# Altium project control_plane (ye-sheng kuo's conflicted copy 2015-02-11).PrjPcb
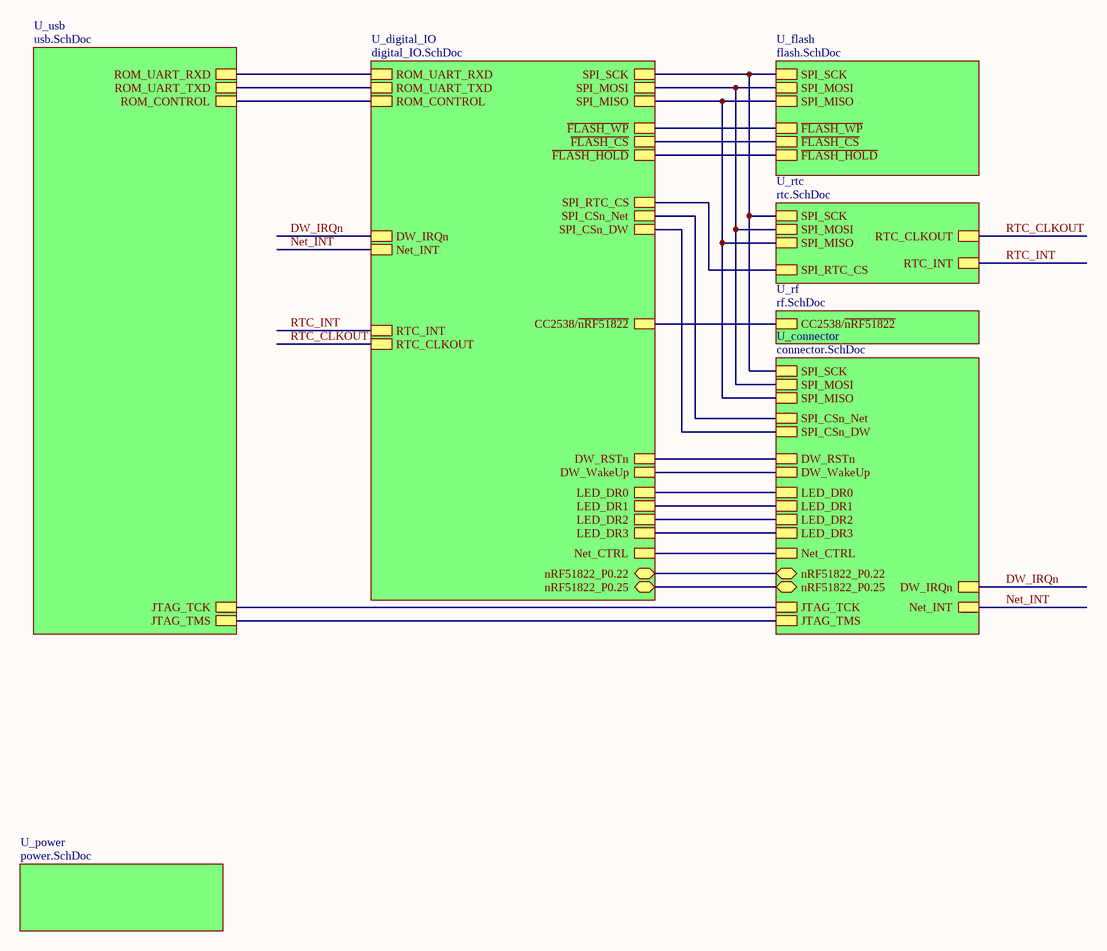
[diagram p0: top.SchDoc]
8 sheets, 101 parts. Net scope: hierarchical (ports join the sheet entries above them; power ports are global).
Board file: control_plane.PcbDoc
Sheets:
  top.SchDoc
    U_digital_IO = digital_IO.SchDoc
    U_flash = flash.SchDoc
    U_power = power.SchDoc
    U_rf = rf.SchDoc
    U_rtc = rtc.SchDoc
    U_usb = usb.SchDoc
    U_connector = connector.SchDoc

## Sheet top.SchDoc: Control Plane
size Letter; Author: Ye-Sheng Kuo; Revision: 2; SheetNumber: 1; SheetTotal: 8

### Sub-sheets
U_connector = connector.SchDoc: JTAG_TCK, JTAG_TMS, SPI_SCK, SPI_MOSI, SPI_MISO, SPI_CSn_Net, DW_RSTn, DW_WakeUp, DW_IRQn, Net_INT, LED_DR0, LED_DR1, LED_DR2, LED_DR3, Net_CTRL, SPI_CSn_DW, nRF51822_P0.22, nRF51822_P0.25
U_digital_IO = digital_IO.SchDoc: ROM_UART_RXD, ROM_UART_TXD, ROM_CONTROL, ~{FLASH_WP}, ~{FLASH_CS}, ~{FLASH_HOLD}, RTC_CLKOUT, SPI_SCK, SPI_MOSI, SPI_MISO, CC2538/~{nRF51822}, SPI_RTC_CS, RTC_INT, SPI_CSn_Net, SPI_CSn_DW, DW_RSTn, DW_WakeUp, DW_IRQn, Net_INT, LED_DR0, LED_DR1, LED_DR2, LED_DR3, Net_CTRL, nRF51822_P0.22, nRF51822_P0.25
U_flash = flash.SchDoc: ~{FLASH_WP}, ~{FLASH_CS}, ~{FLASH_HOLD}, SPI_SCK, SPI_MOSI, SPI_MISO
U_power = power.SchDoc: no entries
U_rf = rf.SchDoc: CC2538/~{nRF51822}
U_rtc = rtc.SchDoc: SPI_SCK, SPI_MOSI, SPI_MISO, SPI_RTC_CS, RTC_INT, RTC_CLKOUT
U_usb = usb.SchDoc: ROM_UART_RXD, ROM_UART_TXD, ROM_CONTROL, JTAG_TCK, JTAG_TMS

### Nets
CC2538/~{nRF51822}: sheet U_digital_IO/CC2538/~{nRF51822}, sheet U_rf/CC2538/~{nRF51822}
DW_IRQn: sheet U_digital_IO/DW_IRQn, sheet U_connector/DW_IRQn
DW_RSTn: sheet U_digital_IO/DW_RSTn, sheet U_connector/DW_RSTn
DW_WakeUp: sheet U_digital_IO/DW_WakeUp, sheet U_connector/DW_WakeUp
~{FLASH_CS}: sheet U_digital_IO/~{FLASH_CS}, sheet U_flash/~{FLASH_CS}
~{FLASH_HOLD}: sheet U_digital_IO/~{FLASH_HOLD}, sheet U_flash/~{FLASH_HOLD}
~{FLASH_WP}: sheet U_digital_IO/~{FLASH_WP}, sheet U_flash/~{FLASH_WP}
JTAG_TCK: sheet U_usb/JTAG_TCK, sheet U_connector/JTAG_TCK
JTAG_TMS: sheet U_usb/JTAG_TMS, sheet U_connector/JTAG_TMS
LED_DR0: sheet U_digital_IO/LED_DR0, sheet U_connector/LED_DR0
LED_DR1: sheet U_digital_IO/LED_DR1, sheet U_connector/LED_DR1
LED_DR2: sheet U_digital_IO/LED_DR2, sheet U_connector/LED_DR2
LED_DR3: sheet U_digital_IO/LED_DR3, sheet U_connector/LED_DR3
Net_CTRL: sheet U_digital_IO/Net_CTRL, sheet U_connector/Net_CTRL
Net_INT: sheet U_digital_IO/Net_INT, sheet U_connector/Net_INT
nRF51822_P0.22: sheet U_digital_IO/nRF51822_P0.22, sheet U_connector/nRF51822_P0.22
nRF51822_P0.25: sheet U_digital_IO/nRF51822_P0.25, sheet U_connector/nRF51822_P0.25
RTC_CLKOUT: sheet U_digital_IO/RTC_CLKOUT, sheet U_rtc/RTC_CLKOUT
RTC_INT: sheet U_digital_IO/RTC_INT, sheet U_rtc/RTC_INT
SPI_CSn_DW: sheet U_digital_IO/SPI_CSn_DW, sheet U_connector/SPI_CSn_DW
SPI_CSn_Net: sheet U_digital_IO/SPI_CSn_Net, sheet U_connector/SPI_CSn_Net
SPI_MISO: sheet U_digital_IO/SPI_MISO, sheet U_flash/SPI_MISO, sheet U_rtc/SPI_MISO, sheet U_connector/SPI_MISO
SPI_MOSI: sheet U_digital_IO/SPI_MOSI, sheet U_flash/SPI_MOSI, sheet U_rtc/SPI_MOSI, sheet U_connector/SPI_MOSI
SPI_RTC_CS: sheet U_digital_IO/SPI_RTC_CS, sheet U_rtc/SPI_RTC_CS
SPI_SCK: sheet U_digital_IO/SPI_SCK, sheet U_flash/SPI_SCK, sheet U_rtc/SPI_SCK, sheet U_connector/SPI_SCK
NetU3_16: sheet U_digital_IO/ROM_UART_RXD, sheet U_usb/ROM_UART_RXD
NetU3_17: sheet U_digital_IO/ROM_UART_TXD, sheet U_usb/ROM_UART_TXD
NetU3_18: sheet U_digital_IO/ROM_CONTROL, sheet U_usb/ROM_CONTROL

### Notes on the sheet
- Title
- Date:
- Author:
- Revision:
- Sheet
- of
- University of Michigan
- File:

## Sheet digital_IO.SchDoc: Control Plane
size Letter; Author: Ye-Sheng Kuo; Revision: 2; SheetNumber: 4; SheetTotal: 8
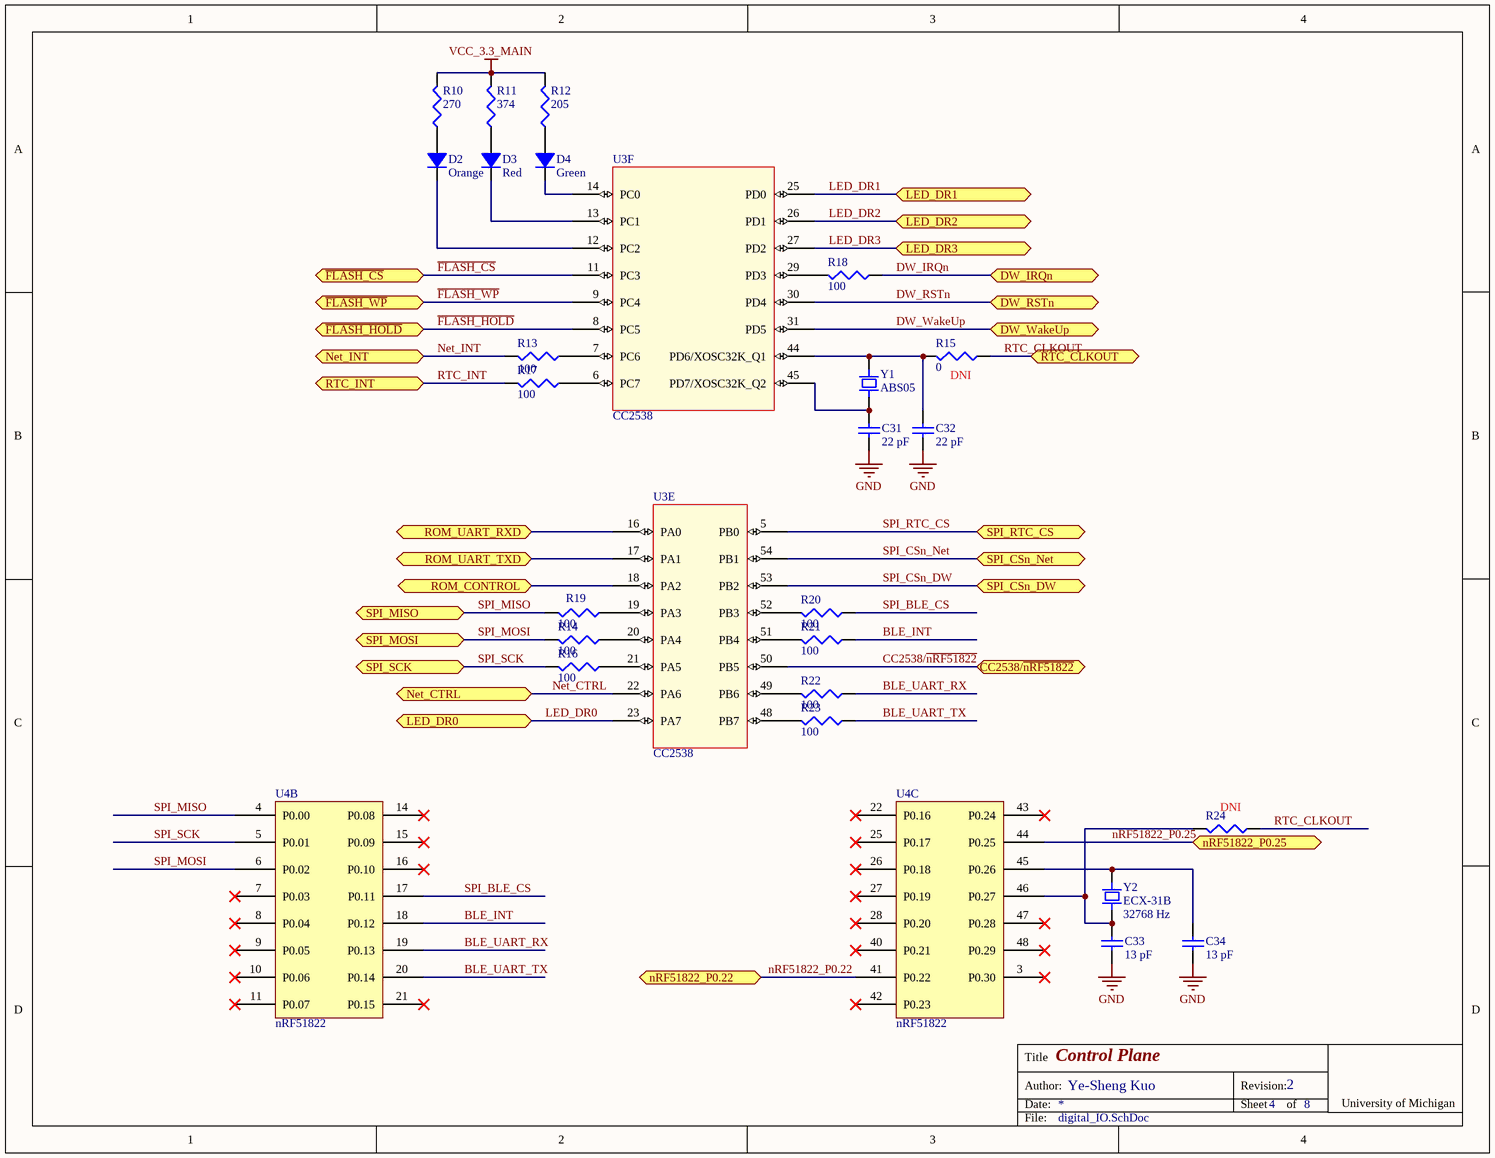
[diagram p1: digital_IO.SchDoc]

### Parts
C31  value 22 pF  [0402]  (hidden comment: Ceramic capacitor)
C32  value 22 pF  [0402]  (hidden comment: Ceramic capacitor)
C33  value 13 pF  [0402]  (hidden comment: Ceramic capacitor)
C34  value 13 pF  [0402]  (hidden comment: Ceramic capacitor)
D2  Color: Orange  [0402 - DIODE]  (hidden comment: LED, Orange)
D3  Color: Red  [0402 - DIODE]  (hidden comment: LED, Red)
D4  Color: Green  [0402 - DIODE]  (hidden comment: LED, Green)
R10  value 270  [0402]  (hidden comment: Chip resistor)
R11  value 374  [0402]  (hidden comment: Chip resistor)
R12  value 205  [0402]  (hidden comment: Chip resistor)
R13  value 100  [0402]  (hidden comment: Chip resistor)
R14  value 100  [0402]  (hidden comment: Chip resistor)
R15  value 0  [0402]  (hidden comment: Chip resistor)
R16  value 100  [0402]  (hidden comment: Chip resistor)
R17  value 100  [0402]  (hidden comment: Chip resistor)
R18  value 100  [0402]  (hidden comment: Chip resistor)
R19  value 100  [0402]  (hidden comment: Chip resistor)
R20  value 100  [0402]  (hidden comment: Chip resistor)
R21  value 100  [0402]  (hidden comment: Chip resistor)
R22  value 100  [0402]  (hidden comment: Chip resistor)
R23  value 100  [0402]  (hidden comment: Chip resistor)
R24  value 0  [0402]  (hidden comment: Chip resistor)
U3  CC2538  [QFN56]  (parts E,F of 6)
U4  nRF51822  [QFN-48]  (parts B,C of 5)
Y1  ABS05  [ABS05]
Y2  ECX-31B  Frequency: 32768 Hz  [ECX-31B]

### Ports
CC2538/~{nRF51822}, DW_IRQn, DW_RSTn, DW_WakeUp, LED_DR0, LED_DR1, LED_DR2, LED_DR3, Net_CTRL, Net_INT, nRF51822_P0.22, nRF51822_P0.25, ROM_CONTROL, ROM_UART_RXD, ROM_UART_TXD, RTC_CLKOUT, RTC_INT, SPI_CSn_DW, SPI_CSn_Net, SPI_MISO, SPI_MOSI, SPI_RTC_CS, SPI_SCK, ~{FLASH_CS}, ~{FLASH_HOLD}, ~{FLASH_WP}

### Nets
GND: C31.2 C32.2 C33.2 C34.2
VCC_3.3_MAIN: R10.1 R11.1 R12.1
BLE_INT: R21.2 U4.18(P0.12)
BLE_UART_RX: R22.2 U4.19(P0.13)
BLE_UART_TX: R23.2 U4.20(P0.14)
CC2538/~{nRF51822}: U3.50(PB5) ; port CC2538/~{nRF51822}
DW_IRQn: R18.2 ; port DW_IRQn
DW_RSTn: U3.30(PD4) ; port DW_RSTn
DW_WakeUp: U3.31(PD5) ; port DW_WakeUp
~{FLASH_CS}: U3.11(PC3) ; port ~{FLASH_CS}
~{FLASH_HOLD}: U3.8(PC5) ; port ~{FLASH_HOLD}
~{FLASH_WP}: U3.9(PC4) ; port ~{FLASH_WP}
LED_DR0: U3.23(PA7) ; port LED_DR0
LED_DR1: U3.25(PD0) ; port LED_DR1
LED_DR2: U3.26(PD1) ; port LED_DR2
LED_DR3: U3.27(PD2) ; port LED_DR3
Net_CTRL: U3.22(PA6) ; port Net_CTRL
Net_INT: R13.1 ; port Net_INT
nRF51822_P0.22: U4.41(P0.22) ; port nRF51822_P0.22
nRF51822_P0.25: U4.44(P0.25) ; port nRF51822_P0.25
RTC_CLKOUT: R15.2 R24.2 ; port RTC_CLKOUT
RTC_INT: R17.1 ; port RTC_INT
SPI_BLE_CS: R20.2 U4.17(P0.11)
SPI_CSn_DW: U3.53(PB2) ; port SPI_CSn_DW
SPI_CSn_Net: U3.54(PB1) ; port SPI_CSn_Net
SPI_MISO: R19.1 U4.4(P0.00) ; port SPI_MISO
SPI_MOSI: R14.1 U4.6(P0.02) ; port SPI_MOSI
SPI_RTC_CS: U3.5(PB0) ; port SPI_RTC_CS
SPI_SCK: R16.1 U4.5(P0.01) ; port SPI_SCK
NetC31_1: C31.1 U3.45(PD7/XOSC32K_Q2) Y1.2
NetC32_1: C32.1 R15.1 U3.44(PD6/XOSC32K_Q1) Y1.1
NetC33_1: C33.1 R24.1 U4.46(P0.27) Y2.2
NetC34_1: C34.1 U4.45(P0.26) Y2.1
NetD2_1: D2.1 R10.2
NetD2_2: D2.2 U3.12(PC2)
NetD3_1: D3.1 R11.2
NetD3_2: D3.2 U3.13(PC1)
NetD4_1: D4.1 R12.2
NetD4_2: D4.2 U3.14(PC0)
NetR13_2: R13.2 U3.7(PC6)
NetR14_2: R14.2 U3.20(PA4)
NetR16_2: R16.2 U3.21(PA5)
NetR17_2: R17.2 U3.6(PC7)
NetR18_1: R18.1 U3.29(PD3)
NetR19_2: R19.2 U3.19(PA3)
NetR20_1: R20.1 U3.52(PB3)
NetR21_1: R21.1 U3.51(PB4)
NetR22_1: R22.1 U3.49(PB6)
NetR23_1: R23.1 U3.48(PB7)
NetU3_16: U3.16(PA0) ; port ROM_UART_RXD
NetU3_17: U3.17(PA1) ; port ROM_UART_TXD
NetU3_18: U3.18(PA2) ; port ROM_CONTROL

Not connected (* = marked no-connect by the designer): U4 3(P0.30)* 7(P0.03)* 8(P0.04)* 9(P0.05)* 10(P0.06)* 11(P0.07)* 14(P0.08)* 15(P0.09)* 16(P0.10)* 21(P0.15)* 22(P0.16)* 25(P0.17)* 26(P0.18)* 27(P0.19)* 28(P0.20)* 40(P0.21)* 42(P0.23)* 43(P0.24)* 47(P0.28)* 48(P0.29)*

### Notes on the sheet
- (near R15) DNI
- (near R24) DNI
- Title
- Date:
- Author:
- Revision:
- Sheet
- of
- University of Michigan
- File:

### Library data of the parts
C31 C32 = C_22p_0402_ceramic: Ceramic capacitor, 22 pF, 0402 package; Manufacture: Johanson; voltage rated: 50 V; tolerance: 2%; package: 0402; Supplier 1: Digi-Key; Supplier Part Number 1: 712-1274-1-ND
C33 C34 = C_13p_0402_50V_ceramic: Ceramic capacitor, 13 pF, 50 V, 0402 package; Manufacture: Murata; voltage rated: 50 V; tolerance: 5%; package: 0402; Supplier 1: Digi-Key; Supplier Part Number 1: 490-5925-1-ND
D2 = D_LED_ORANGE_0402: LED, Orange, 0402; Supplier 1: Digi-Key; Supplier Part Number 1: 511-1590-1-ND; package: 0402
D3 = D_LED_RED_0402: LED, Red, 0402; package: 0402; Supplier 1: Digi-Key; Supplier Part Number 1: 511-1593-1-ND
D4 = D_LED_GREEN_0402: LED, Green,  0402; package: 0402; Supplier 1: Digi-Key; Supplier Part Number 1: 511-1592-1-ND
R10 = R_270_0402: Chip resistor, 270, 0402 package; tolerance: 1%; power: 1/16 W; package: 0402; Supplier 1: Digi-Key; Supplier Part Number 1: 541-270LCT-ND
R11 = R_374_0402: Chip resistor, 374, 0402 package; tolerance: 1%; power: 1/16 W; package: 0402; Supplier 1: Digi-Key; Supplier Part Number 1: 541-374LCT-ND
R12 = R_205_0402: Chip resistor, 205, 0402 package; tolerance: 1%; power: 1/16 W; package: 0402; Supplier 1: Digi-Key; Supplier Part Number 1: 541-205LCT-ND
R13 R14 R16-R23 = R_100_0402: Chip resistor, 100, 0402 package; tolerance: 1%; power: 1/16 W; package: 0402; Supplier 1: Digi-Key; Supplier Part Number 1: 541-100LCT-ND
R15 R24 = R_0_0402: Chip resistor, 0, 0402 package; package: 0402; Supplier 1: Digi-Key; Supplier Part Number 1: 541-0.0YBCT-ND
U3 = CC2538: A Powerful System-On-Chip for 2.4-GHz IEEE 802.15.4, 6LoWPAN  and ZigBee Applications; Supplier 1: Digi-Key; Supplier Part Number 1: 296-35797-1-ND
U4 = nRF51822: Multiprotocol Bluetooth® low energy/2.4 GHz RF System on Chip; Supplier 1: Digi-Key; Supplier Part Number 1: 1490-1032-1-ND
Y1 = ABS05: 32768 Hz SMD Low profile crystal; Supplier 1: Digi-Key; Supplier Part Number 1: 535-11899-1-ND
Y2 = ECX-31B: SMD TUNING FORK CRYSTAL; Load capacitance: 9 pF; ESR: 70 Kohm; Shunt capacitance: 1.05 pF; Frequency tolerance: 20 ppm; Supplier 1: Digi-Key; Supplier Part Number 1: XC1950CT-ND

## Sheet flash.SchDoc: Control Plane
size Letter; Author: Ye-Sheng Kuo; Revision: 2; SheetNumber: 5; SheetTotal: 8
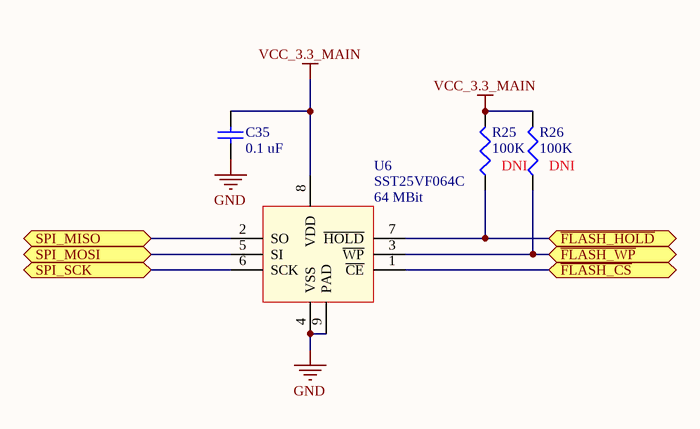
[diagram p2: flash.SchDoc]

### Parts
C35  value 0.1 uF  [0402]  (hidden comment: Ceramic capacitor)
R25  value 100K  [0402]  (hidden comment: Chip resistor)
R26  value 100K  [0402]  (hidden comment: Chip resistor)
U6  SST25VF064C  Capacity: 64 MBit  [WSON]

### Ports
SPI_MISO, SPI_MOSI, SPI_SCK, ~{FLASH_CS}, ~{FLASH_HOLD}, ~{FLASH_WP}

### Nets
GND: C35.2 U6.4(VSS) U6.9(PAD)
VCC_3.3_MAIN: C35.1 R25.1 R26.1 U6.8(VDD)
~{FLASH_CS}: U6.1(~{CE}) ; port ~{FLASH_CS}
~{FLASH_HOLD}: R25.2 U6.7(~{HOLD}) ; port ~{FLASH_HOLD}
~{FLASH_WP}: R26.2 U6.3(~{WP}) ; port ~{FLASH_WP}
SPI_MISO: U6.2(SO) ; port SPI_MISO
SPI_MOSI: U6.5(SI) ; port SPI_MOSI
SPI_SCK: U6.6(SCK) ; port SPI_SCK

### Notes on the sheet
- DNI
- (near R26) DNI
- Title
- Date:
- Author:
- Revision:
- Sheet
- of
- University of Michigan
- File:

### Library data of the parts
C35 = C_0.1u_10V_0402_ceramic: Ceramic capacitor, 0.1u, 0402 package; Manufacture: TDK; voltage rated: 10 V; tolerance: 10%; Supplier 1: Digi-Key; Supplier Part Number 1: 445-1265-1-ND; package: 0402
R25 R26 = R_100K_0402: Chip resistor, 100K, 0402 package; tolerance: 1%; power: 1/16 W; Supplier 1: Digi-Key; Supplier Part Number 1: 541-100KLCT-ND; package: 0402
U6 = SST25VF064C: 64 Mbit SPI Serial Dual I/O Flash; Supplier 1: Digi-Key; Supplier Part Number 1: SST25VF064C-80-4I-Q2AE-CT-ND

## Sheet power.SchDoc: Control Plane
size Letter; Author: Ye-Sheng Kuo; Revision: 2; SheetNumber: 2; SheetTotal: 8
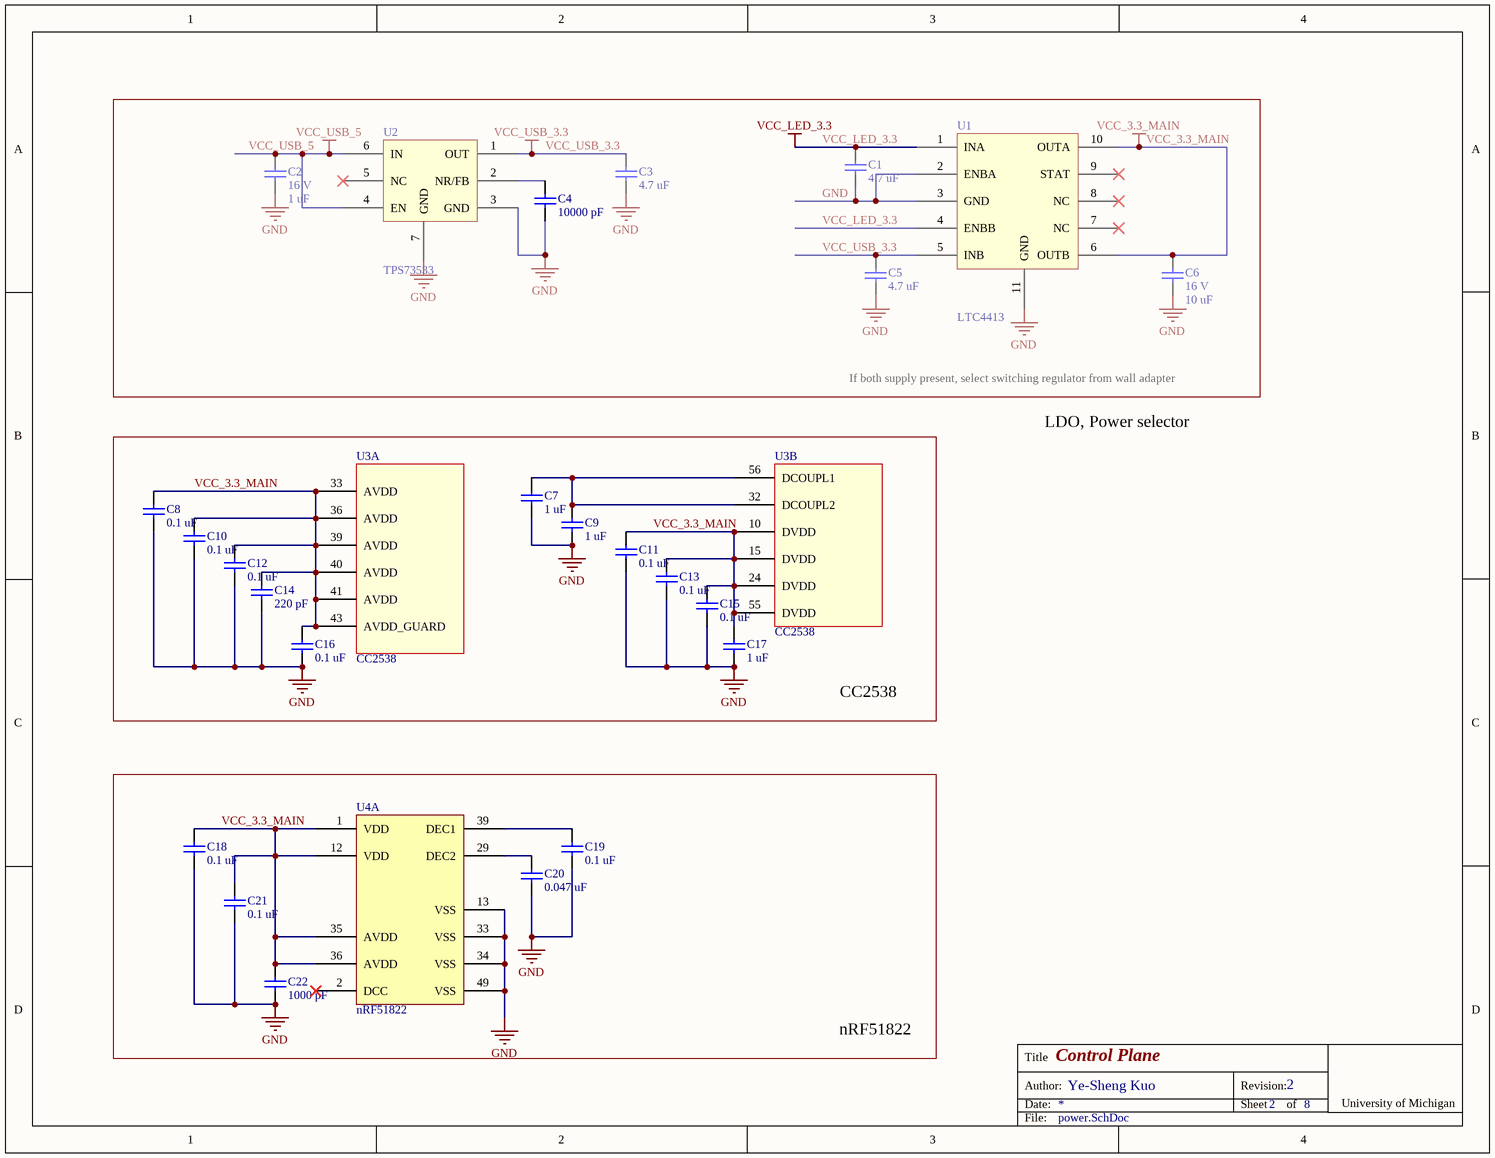
[diagram p3: power.SchDoc]

### Parts
C1  value 4.7 uF  [0603]  (hidden comment: Ceramic capacitor)
C2  value 1 uF  voltage rated: 16 V  [0603]  (hidden comment: Ceramic capacitor)
C3  value 4.7 uF  [0603]  (hidden comment: Ceramic capacitor)
C4  value 10000 pF  [0402]  (hidden comment: Ceramic capacitor)
C5  value 4.7 uF  [0603]  (hidden comment: Ceramic capacitor)
C6  value 10 uF  voltage rated: 16 V  [0603]  (hidden comment: Ceramic capacitor)
C7  value 1 uF  [0402]  (hidden comment: Ceramic capacitor)
C8  value 0.1 uF  [0402]  (hidden comment: Ceramic capacitor)
C9  value 1 uF  [0402]  (hidden comment: Ceramic capacitor)
C10  value 0.1 uF  [0402]  (hidden comment: Ceramic capacitor)
C11  value 0.1 uF  [0402]  (hidden comment: Ceramic capacitor)
C12  value 0.1 uF  [0402]  (hidden comment: Ceramic capacitor)
C13  value 0.1 uF  [0402]  (hidden comment: Ceramic capacitor)
C14  value 220 pF  [0402]  (hidden comment: Ceramic capacitor)
C15  value 0.1 uF  [0402]  (hidden comment: Ceramic capacitor)
C16  value 0.1 uF  [0402]  (hidden comment: Ceramic capacitor)
C17  value 1 uF  [0402]  (hidden comment: Ceramic capacitor)
C18  value 0.1 uF  [0402]  (hidden comment: Ceramic capacitor)
C19  value 0.1 uF  [0402]  (hidden comment: Ceramic capacitor)
C20  value 0.047 uF  [0402]  (hidden comment: Ceramic capacitor)
C21  value 0.1 uF  [0402]  (hidden comment: Ceramic capacitor)
C22  value 1000 pF  [0402]  (hidden comment: Ceramic capacitor)
U1  LTC4413  [DFN-10]
U2  TPS73533  [SON-6]
U3  CC2538  [QFN56]  (parts A,B of 6)
U4  nRF51822  [QFN-48]  (part A of 5)

### Nets
GND: C1.2 C2.2 C3.2 C4.2 C5.2 C6.2 C7.2 C8.2 C9.2 C10.2 C11.2 C12.2 C13.2 C14.2 C15.2 C16.2 C17.2 C18.2 C19.2 C20.2 C21.2 C22.2 U1.2(ENBA) U1.3(GND) U1.11(GND) U2.3(GND) U2.7(GND) U4.13(VSS) U4.33(VSS) U4.34(VSS) U4.49(VSS)
VCC_3.3_MAIN: C6.1 C8.1 C10.1 C11.1 C12.1 C13.1 C14.1 C15.1 C16.1 C17.1 C18.1 C21.1 C22.1 U1.6(OUTB) U1.10(OUTA) U3.10(DVDD) U3.15(DVDD) U3.24(DVDD) U3.33(AVDD) U3.36(AVDD) U3.39(AVDD) U3.40(AVDD) U3.41(AVDD) U3.43(AVDD_GUARD) U3.55(DVDD) U4.1(VDD) U4.12(VDD) U4.35(AVDD) U4.36(AVDD)
VCC_LED_3.3: C1.1 U1.1(INA) U1.4(ENBB)
VCC_USB_3.3: C3.1 C5.1 U1.5(INB) U2.1(OUT)
VCC_USB_5: C2.1 U2.4(EN) U2.6(IN)
NetC4_1: C4.1 U2.2(NR/FB)
NetC7_1: C7.1 C9.1 U3.32(DCOUPL2) U3.56(DCOUPL1)
NetC19_1: C19.1 U4.39(DEC1)
NetC20_1: C20.1 U4.29(DEC2)

Not connected (* = marked no-connect by the designer): U1 7(NC)* 8(NC)* 9(STAT)*; U2 5(NC)*; U4 2(DCC)*

### Notes on the sheet
- If both supply present, select switching regulator from wall adapter
- LDO, Power selector
- CC2538
- nRF51822
- Title
- Date:
- Author:
- Revision:
- Sheet
- of
- University of Michigan
- File:

### Library data of the parts
C1 C3 C5 = C_4.7u_10V_0603_ceramic: Ceramic capacitor, 4.7u, 10V, 0603 package; Manufacture: TDK; tolerance: 20%; Temp rating: X5R; package: 0603; voltage rated: 10 V; Supplier 1: Digi-Key; Supplier Part Number 1: 445-7482-1-ND
C2 = C_1u_16V_0603_ceramic: Ceramic capacitor, 1 uF, 16 V, 0603 package; Manufacture: TDK; tolerance: 10%; package: 0603; Supplier 1: Digi-Key; Supplier Part Number 1: 445-1604-1-ND
C4 = C_10000p_16V_0402_ceramic: Ceramic capacitor, 10000 pF, 16 V, 0402 package; Manufacture: Murata; voltage rated: 16 V; tolerance: 10%; Temperature Coefficient: X7R; package: 0402; Supplier 1: Digi-Key; Supplier Part Number 1: 490-1313-1-ND
C6 = C_10u_16V_0603_ceramic: Ceramic capacitor, 10 uF, 16 V, 0603 package; Manufacture: TDK; tolerance: 20%; Temperature Coefficient: X5R; package: 0603; Supplier 1: Digi-Key; Supplier Part Number 1: 445-9065-6-ND
C7 C9 C17 = C_1u_16V_0402_ceramic: Ceramic capacitor, 1 uF, 16V, 0402 package; Manufacture: TDK; tolerance: 10%; Temperature rating: X5R; voltage rated: 16 V; package: 0402; Supplier 1: Digi-Key; Supplier Part Number 1: 445-4978-1-ND
C8 C10-C13 C15 C16 C18 C19 C21 = C_0.1u_10V_0402_ceramic: as C35 on sheet flash; Supplier 1: Digi-Key; Supplier Part Number 1: 445-1265-1-ND; package: 0402
C14 = C_220p_50V_0402_ceramic: Ceramic capacitor, 220 pF, 0402 package; Manufacture: Johanson; voltage rated: 50 V; tolerance: 10%; package: 0402; Temperature: X7R; Supplier 1: Digi-Key; Supplier Part Number 1: 445-1254-1-ND
C20 = C_0.047u_16V_0402_ceramic: Ceramic capacitor, 0.047u, 16V, 0402 package; Manufacture: TDK; tolerance: 10%; Temperature rating: X7R; voltage rated: 16 V; package: 0402; Supplier 1: Digi-Key; Supplier Part Number 1: 445-1264-1-ND
C22 = C_1000p_50V_0402_ceramic: Ceramic capacitor, 1000 pF, 0402 package; Manufacture: TDK; voltage rated: 50 V; tolerance: 10%; package: 0402; Supplier 1: Digi-Key; Supplier Part Number 1: 445-6846-1-ND
U1 = LTC4413: Dual 2.6A, 2.5V to 5.5V,  Ideal Diodes in 3mm × 3mm DFN; Supplier 1: Digi-Key; Supplier Part Number 1: LTC4413EDD#TRPBFCT-ND
U2 = TPS73533: 500mA, Low Quiescent Current, Ultra-Low Noise, High PSRR  Low-Dropout Linear Regulator; Supplier 1: Digi-Key; Supplier Part Number 1: 296-24289-1-ND
U3 = CC2538: as U3 on sheet digital_IO; Supplier 1: Digi-Key; Supplier Part Number 1: 296-35797-1-ND
U4 = nRF51822: as U4 on sheet digital_IO; Supplier 1: Digi-Key; Supplier Part Number 1: 1490-1032-1-ND

## Sheet rf.SchDoc: Control Plane
size Letter; Author: Ye-Sheng Kuo; Revision: 2; SheetNumber: 7; SheetTotal: 8
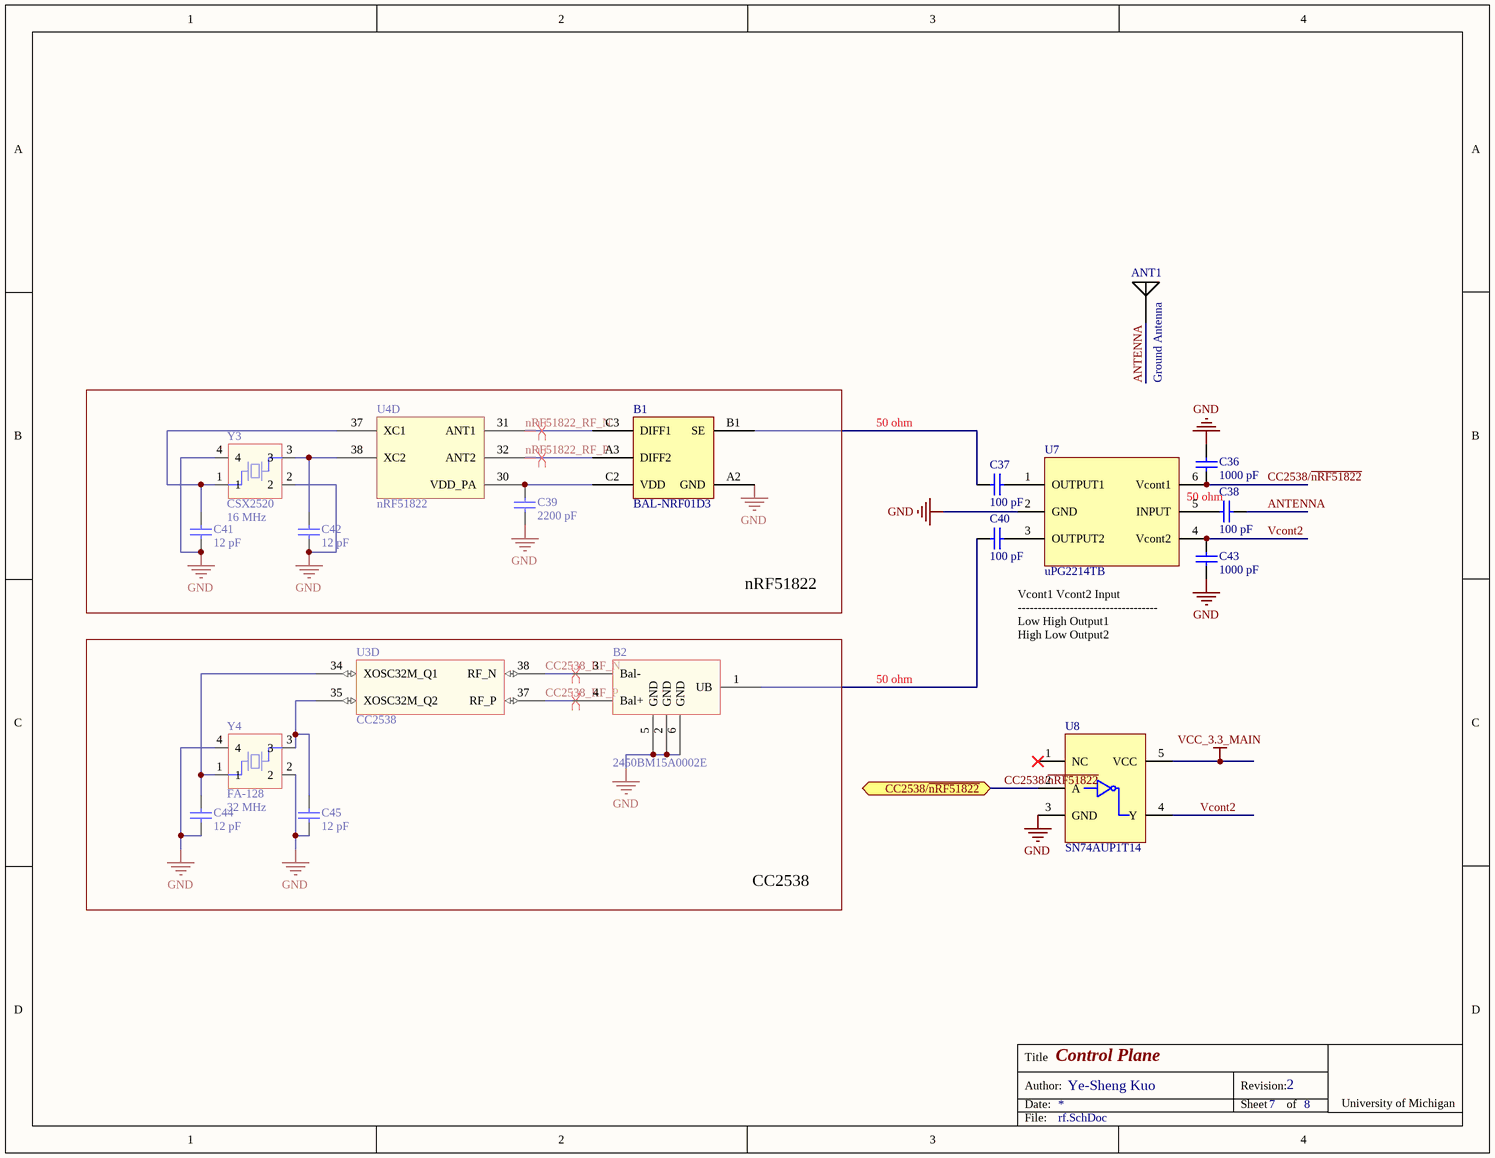
[diagram p4: rf.SchDoc]

### Parts
ANT1  Ground Antenna  [Chip Antenna]
B1  BAL-NRF01D3  [BAL-NRF01D3]
B2  2450BM15A0002E  [2450BM15A0002]
C36  value 1000 pF  [0402]  (hidden comment: Ceramic capacitor)
C37  value 100 pF  [0402]  (hidden comment: Ceramic capacitor)
C38  value 100 pF  [0402]  (hidden comment: Ceramic capacitor)
C39  value 2200 pF  [0402]  (hidden comment: Ceramic capacitor)
C40  value 100 pF  [0402]  (hidden comment: Ceramic capacitor)
C41  value 12 pF  [0402]  (hidden comment: Ceramic capacitor)
C42  value 12 pF  [0402]  (hidden comment: Ceramic capacitor)
C43  value 1000 pF  [0402]  (hidden comment: Ceramic capacitor)
C44  value 12 pF  [0402]  (hidden comment: Ceramic capacitor)
C45  value 12 pF  [0402]  (hidden comment: Ceramic capacitor)
U3  CC2538  [QFN56]  (part D of 6)
U4  nRF51822  [QFN-48]  (part D of 5)
U7  uPG2214TB  [minimold-6]
U8  SN74AUP1T14  [SC-70-5 (DCK)]
Y3  CSX2520  Frequency: 16 MHz  [CX2520]
Y4  FA-128  frequency: 32 MHz  [FA-128]

### Ports
CC2538/~{nRF51822}

### Nets
GND: B1.A2(GND) B2.2(GND) B2.5(GND) B2.6(GND) C36.1 C39.2 C41.1 C42.1 C43.2 C44.1 C45.1 U7.2(GND) U8.3(GND) Y3.2 Y3.4 Y4.2 Y4.4
VCC_3.3_MAIN: U8.5(VCC)
ANTENNA: ANT1.1 C38.2
CC2538/~{nRF51822}: C36.2 U7.6(Vcont1) U8.2(A) ; port CC2538/~{nRF51822}
CC2538_RF_N: B2.3(Bal-) U3.38(RF_N)
CC2538_RF_P: B2.4(Bal+) U3.37(RF_P)
nRF51822_RF_N: B1.C3(DIFF1) U4.31(ANT1)
nRF51822_RF_P: B1.A3(DIFF2) U4.32(ANT2)
Vcont2: C43.1 U7.4(Vcont2) U8.4(Y)
NetB1_B1: B1.B1(SE) C37.1
NetB1_C2: B1.C2(VDD) C39.1 U4.30(VDD_PA)
NetB2_1: B2.1(UB) C40.1
NetC37_2: C37.2 U7.1(OUTPUT1)
NetC38_1: C38.1 U7.5(INPUT)
NetC40_2: C40.2 U7.3(OUTPUT2)
NetC41_2: C41.2 U4.37(XC1) Y3.1
NetC42_2: C42.2 U4.38(XC2) Y3.3
NetC44_2: C44.2 U3.34(XOSC32M_Q1) Y4.1
NetC45_2: C45.2 U3.35(XOSC32M_Q2) Y4.3

Not connected (* = marked no-connect by the designer): U8 1(NC)*

### Layout directives
differential pair: CC2538_RF_N, CC2538_RF_P, nRF51822_RF_N, nRF51822_RF_P

### Notes on the sheet
- 50 ohm
- nRF51822
- (near C43) Vcont1	Vcont2	Input
  -----------------------------------
  Low	High	Output1
  High	Low	Output2
- CC2538
- Title
- Date:
- Author:
- Revision:
- Sheet
- of
- University of Michigan
- File:

### Library data of the parts
ANT1 = Ground Antenna: 2.4GHz Surface Mount Device (SMD) On Ground Antenna, 50 Ohms; Supplier 1: RichardsonRFPD; Supplier Part Number 1: FR05-S1-N-0102B
B1 = BAL-NRF01D3: 50 ohm nominal input / conjugate match balun to nRF51822-CEAA; Supplier 1: Digi-Key; Supplier Part Number 1: 497-13637-1-ND
B2 = 2450BM15A0002E: 2.45 GHz Balun for TI CC253X; Supplier 1: Digi-Key; Supplier Part Number 1: 712-1536-1-ND
C36 C43 = C_1000p_50V_0402_ceramic: as C22 on sheet power; package: 0402; Supplier 1: Digi-Key; Supplier Part Number 1: 445-6846-1-ND
C37 C38 C40 = C_100p_25V_0402_ceramic: Ceramic capacitor, 100 pF, 0402 package; Manufacture: Kemet; voltage rated: 25 V; tolerance: 1%; package: 0402; Supplier 1: Digi-Key; Supplier Part Number 1: 399-11246-1-ND
C39 = C_2200p_50V_0402_ceramic: Ceramic capacitor, 2200 pF, 0402 package; Manufacture: TDK; voltage rated: 50 V; tolerance: 10%; Temperature Coefficient: X7R; package: 0402; Supplier 1: Digi-Key; Supplier Part Number 1: 445-1257-1-ND
C41 C42 C44 C45 = C_12p_0402_ceramic: Ceramic capacitor, 12 pF, 0402 package; Manufacture: Johanson; voltage rated: 50 V; tolerance: 2%; package: 0402; Supplier 1: Digi-Key; Supplier Part Number 1: 712-1256-1-ND
U3 = CC2538: as U3 on sheet digital_IO; Supplier 1: Digi-Key; Supplier Part Number 1: 296-35797-1-ND
U4 = nRF51822: as U4 on sheet digital_IO; Supplier 1: Digi-Key; Supplier Part Number 1: 1490-1032-1-ND
U7 = uPG2214TB: GaAs Integrated Circuit for L, S-Band SPDT Switch; Supplier 1: Digi-Key; Supplier Part Number 1: UPG2214TB-E4-ACT-ND
U8 = SN74AUP1T14: LOW POWER, 1.8/2.5/3.3-V INPUT, 3.3-V CMOS OUTPUT, SINGLE  SCHMITT-TRIGGER INVERTER GATE; Supplier 1: Digi-Key; Supplier Part Number 1: 296-27392-1-ND
Y3 = CSX2520: Crystal oscillator; Load capacitance: 8 pF; Frequency stability: 15 ppm; Frequency tolerance: 10 ppm; ESR: 80 ohm; Supplier 1: Digi-Key; Supplier Part Number 1: 1253-1121-1-ND
Y4 = FA-128: MHz Range Crystal Unit; Load capatance: 10 pF; ESR: 60; stability: 20 ppm; Supplier 1: Digi-Key; Supplier Part Number 1: SER3800CT-ND

## Sheet rtc.SchDoc: Control Plane
size Letter; Author: Ye-Sheng Kuo; Revision: 2; SheetNumber: 8; SheetTotal: 8
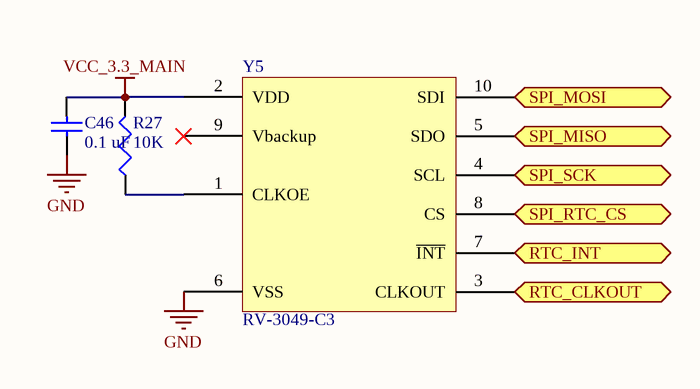
[diagram p5: rtc.SchDoc]

### Parts
C46  value 0.1 uF  [0402]  (hidden comment: Ceramic capacitor)
R27  value 10K  [0402]  (hidden comment: Chip resistor)
Y5  RV-3049-C3  [RV-3049-C3]

### Ports
RTC_CLKOUT, RTC_INT, SPI_MISO, SPI_MOSI, SPI_RTC_CS, SPI_SCK

### Nets
GND: C46.2 Y5.6(VSS)
VCC_3.3_MAIN: C46.1 R27.1 Y5.2(VDD)
RTC_CLKOUT: Y5.3(CLKOUT) ; port RTC_CLKOUT
RTC_INT: Y5.7(~{INT}) ; port RTC_INT
SPI_MISO: Y5.5(SDO) ; port SPI_MISO
SPI_MOSI: Y5.10(SDI) ; port SPI_MOSI
SPI_RTC_CS: Y5.8(CS) ; port SPI_RTC_CS
SPI_SCK: Y5.4(SCL) ; port SPI_SCK
NetR27_2: R27.2 Y5.1(CLKOE)

Not connected (* = marked no-connect by the designer): Y5 9(Vbackup)*

### Notes on the sheet
- Title
- Date:
- Author:
- Revision:
- Sheet
- of
- University of Michigan
- File:

### Library data of the parts
C46 = C_0.1u_10V_0402_ceramic: as C35 on sheet flash; Supplier 1: Digi-Key; Supplier Part Number 1: 445-1265-1-ND; package: 0402
R27 = R_10K_0402: Chip resistor, 10K, 0402 package; tolerance: 1%; power: 1/16 W; Supplier 1: Digi-Key; Supplier Part Number 1: 541-10.0KLDKR-ND; package: 0402
Y5 = RV-3049-C3: Real Time Clock Module with SPI-Bus

## Sheet usb.SchDoc: Control Plane
size Letter; Author: Ye-Sheng Kuo; Revision: 2; SheetNumber: 3; SheetTotal: 8
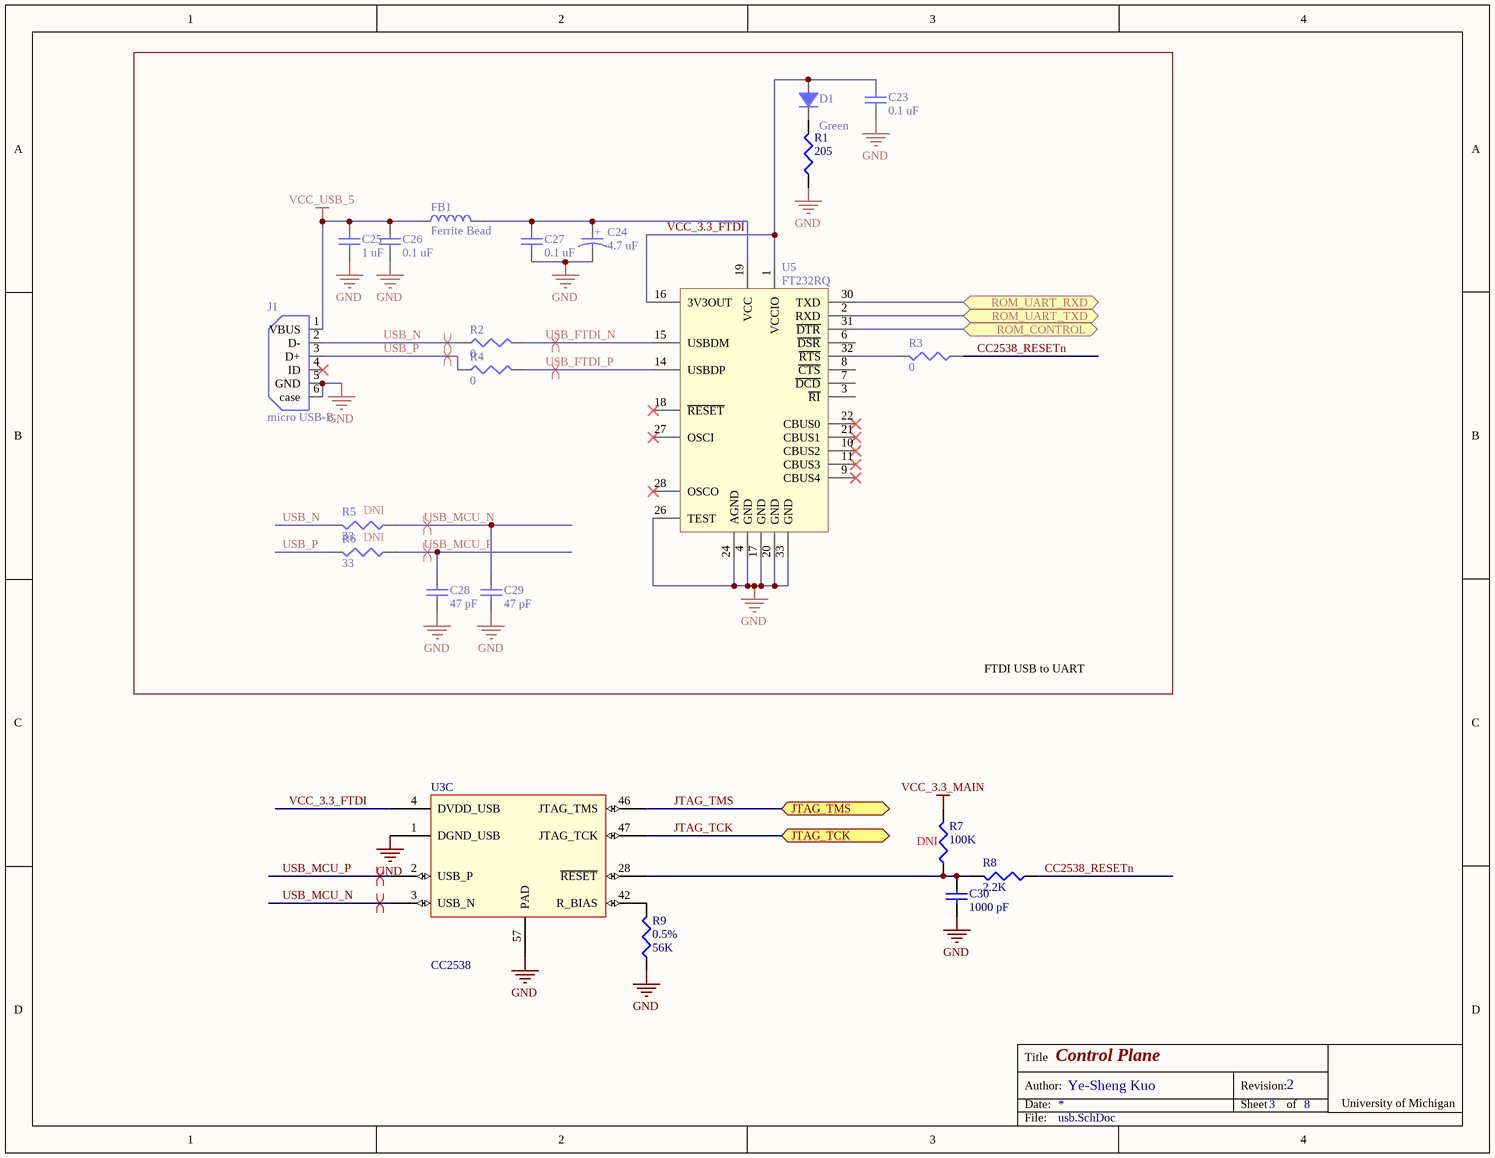
[diagram p6: usb.SchDoc]

### Parts
C23  value 0.1 uF  [0402]  (hidden comment: Ceramic capacitor)
C24  value 4.7 uF  [0603 - Polar Marking]  (hidden comment: Tantalum capacitor)
C25  value 1 uF  [0402]  (hidden comment: Ceramic capacitor)
C26  value 0.1 uF  [0402]  (hidden comment: Ceramic capacitor)
C27  value 0.1 uF  [0402]  (hidden comment: Ceramic capacitor)
C28  value 47 pF  [0402]  (hidden comment: Ceramic capacitor)
C29  value 47 pF  [0402]  (hidden comment: Ceramic capacitor)
C30  value 1000 pF  [0402]  (hidden comment: Ceramic capacitor)
D1  Color: Green  [0402 - DIODE]  (hidden comment: LED, Green)
FB1  Ferrite Bead  [0402]
J1  micro USB-B  [Micro USB-B]
R1  value 205  [0402]  (hidden comment: Chip resistor)
R2  value 0  [0402]  (hidden comment: Chip resistor)
R3  value 0  [0402]  (hidden comment: Chip resistor)
R4  value 0  [0402]  (hidden comment: Chip resistor)
R5  value 33  [0402]  (hidden comment: Chip resistor)
R6  value 33  [0402]  (hidden comment: Chip resistor)
R7  value 100K  [0402]  (hidden comment: Chip resistor)
R8  value 2.2K  [0402]  (hidden comment: Chip resistor)
R9  value 56K  tolerance: 0.5%  [0402]  (hidden comment: Chip resistor)
U3  CC2538  [QFN56]  (part C of 6)
U5  FT232RQ  [QFN-32]

### Ports
JTAG_TCK, JTAG_TMS, ROM_CONTROL, ROM_UART_RXD, ROM_UART_TXD

### Nets
GND: C23.2 C24.2 C25.2 C26.2 C27.2 C28.2 C29.2 C30.2 J1.5(GND) J1.6(case) R1.2 R9.2 U3.1(DGND_USB) U3.57(PAD) U5.4(GND) U5.17(GND) U5.20(GND) U5.24(AGND) U5.26(TEST) U5.33(GND)
VCC_3.3_MAIN: R7.1
VCC_USB_5: C25.1 C26.1 FB1.2 J1.1(VBUS)
CC2538_RESETn: R3.2 R8.2
JTAG_TCK: U3.47(JTAG_TCK) ; port JTAG_TCK
JTAG_TMS: U3.46(JTAG_TMS) ; port JTAG_TMS
USB_FTDI_N: R2.1 U5.15(USBDM)
USB_FTDI_P: R4.1 U5.14(USBDP)
USB_MCU_N: C29.1 R5.2 U3.3(USB_N)
USB_MCU_P: C28.1 R6.2 U3.2(USB_P)
USB_N: J1.2(D-) R2.2 R5.1
USB_P: J1.3(D+) R4.2 R6.1
VCC_3.3_FTDI: C23.1 D1.1 U3.4(DVDD_USB) U5.1(VCCIO) U5.16(3V3OUT)
NetC24_1: C24.1 C27.1 FB1.1 U5.19(VCC)
NetC30_1: C30.1 R7.2 R8.1 U3.28(~{RESET})
NetD1_2: D1.2 R1.1
NetR3_1: R3.1 U5.32(~{RTS})
NetR9_1: R9.1 U3.42(R_BIAS)
NetU3_16: U5.30(TXD) ; port ROM_UART_RXD
NetU3_17: U5.2(RXD) ; port ROM_UART_TXD
NetU3_18: U5.31(~{DTR}) ; port ROM_CONTROL

Not connected (* = marked no-connect by the designer): J1 4(ID)*; U5 3(~{RI}) 6(~{DSR}) 7(~{DCD}) 8(~{CTS}) 9(CBUS4)* 10(CBUS2)* 11(CBUS3)* 18(~{RESET})* 21(CBUS1)* 22(CBUS0)* 27(OSCI)* 28(OSCO)*

### Layout directives
differential pair: USB_FTDI_N, USB_FTDI_P, USB_MCU_N, USB_MCU_P, USB_N, USB_P

### Notes on the sheet
- (near R5) DNI
- DNI
- FTDI USB to UART
- (near R7) DNI
- Title
- Date:
- Author:
- Revision:
- Sheet
- of
- University of Michigan
- File:
- (in symbol C_4.7u_10V_0603_tantalum) +

### Library data of the parts
C23 C26 C27 = C_0.1u_10V_0402_ceramic: as C35 on sheet flash; Supplier 1: Digi-Key; Supplier Part Number 1: 445-1265-1-ND; package: 0402
C24 = C_4.7u_10V_0603_tantalum: Tantalum capacitor, 4.7 uF, 0603 package; Manufacture: Rohm; voltage rated: 10 V; tolerance: 20%; package: 0603; Supplier 1: Digi-Key; Supplier Part Number 1: 511-1496-1-ND
C25 = C_1u_16V_0402_ceramic: as C7 on sheet power; voltage rated: 16 V; package: 0402; Supplier 1: Digi-Key; Supplier Part Number 1: 445-4978-1-ND
C28 C29 = C_47p_0402_ceramic: Ceramic capacitor, 47 pF, 0402 package; Manufacture: Johanson; voltage rated: 50 V; tolerance: 5%; package: 0402; Supplier 1: Digi-Key; Supplier Part Number 1: 709-1121-1-ND
C30 = C_1000p_50V_0402_ceramic: as C22 on sheet power; package: 0402; Supplier 1: Digi-Key; Supplier Part Number 1: 445-6846-1-ND
D1 = D_LED_GREEN_0402: LED, Green,  0402; package: 0402; Supplier 1: Digi-Key; Supplier Part Number 1: 511-1592-1-ND
FB1 = FB_150mA_0402: Ferrite Bead, 150 mA, 0402 package; impedance@Freq: 1K@100 MHz; current rating: 150 mA; Supplier 1: Digi-Key; Supplier Part Number 1: 587-1835-1-ND; package: 0402
J1 = Micro USB: CONN USB MICRO B RECPT SMT R/A; Supplier 1: Digi-Key; Supplier Part Number 1: 609-4616-6-ND
R1 = R_205_0402: as R12 on sheet digital_IO; package: 0402; Supplier 1: Digi-Key; Supplier Part Number 1: 541-205LCT-ND
R2-R4 = R_0_0402: Chip resistor, 0, 0402 package; package: 0402; Supplier 1: Digi-Key; Supplier Part Number 1: 541-0.0YBCT-ND
R5 R6 = R_33_0402: Chip resistor, 33, 0402 package; tolerance: 1%; power: 1/16 W; package: 0402; Supplier 1: Digi-Key; Supplier Part Number 1: 541-33.0LCT-ND
R7 = R_100K_0402: as R25 on sheet flash; Supplier 1: Digi-Key; Supplier Part Number 1: 541-100KLCT-ND; package: 0402
R8 = R_2.2K_0402: Chip resistor, 2.2K, 0402 package; tolerance: 1%; power: 1/16 W; package: 0402; Supplier 1: Digi-Key; Supplier Part Number 1: 541-2.20KLCT-ND
R9 = R_56K_0402: Chip resistor, 56K, 0402 package; power: 1/16 W; Temperature coefficient: 25 ppm/C; package: 0402; Supplier 1: Digi-Key; Supplier Part Number 1: P56KDECT-ND
U3 = CC2538: as U3 on sheet digital_IO; Supplier 1: Digi-Key; Supplier Part Number 1: 296-35797-1-ND
U5 = FT232RQ: FT232R USB UART; Manufacturer: *; Note: *; ManufacturerPartNo: *; Supplier 1: Digi-Key; Supplier Part Number 1: 768-1008-1-ND

## Sheet connector.SchDoc: Control Plane
size Letter; Author: Ye-Sheng Kuo; Revision: 2; SheetNumber: 6; SheetTotal: 8
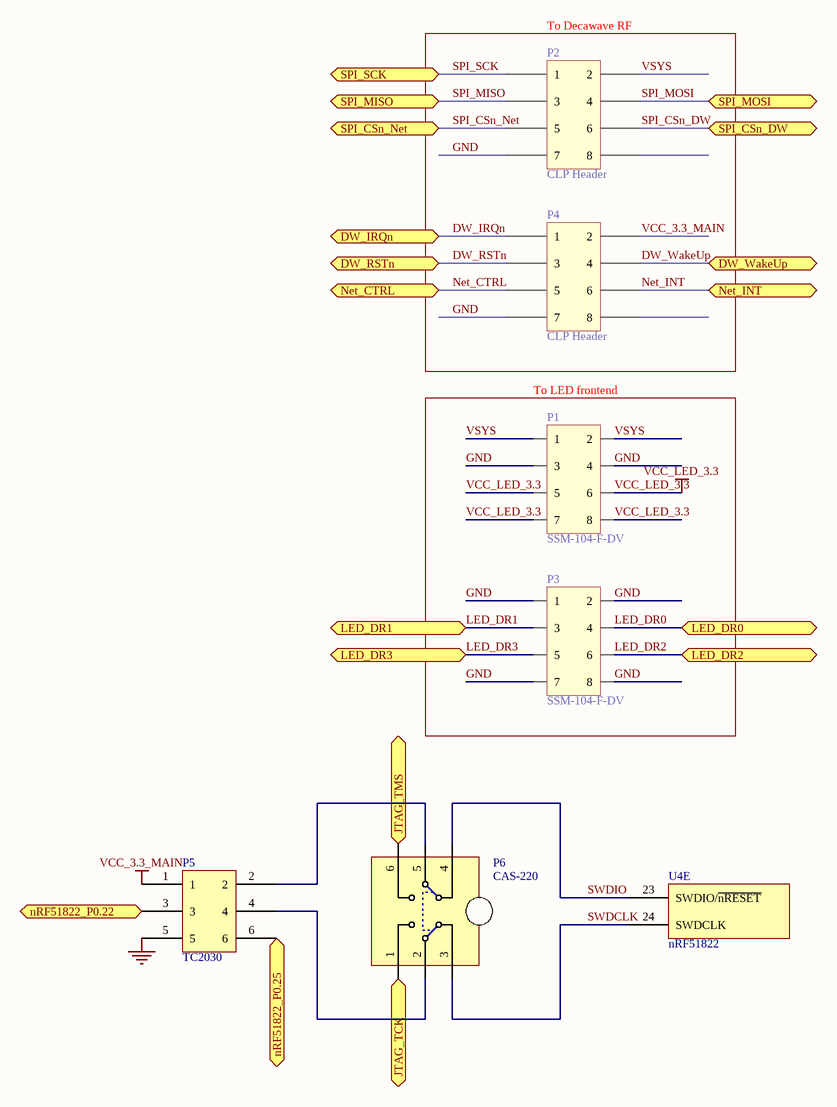
[diagram p7: connector.SchDoc]

### Parts
P1  SSM-104-F-DV  [SSM-104-F-DV]
P2  CLP Header  [SAM_CLP_2_4]
P3  SSM-104-F-DV  [SSM-104-F-DV]
P4  CLP Header  [SAM_CLP_2_4]
P5  TC2030  [TC2030-IDC-NLFP]
P6  CAS-220  [CAS-220A]
U4  nRF51822  [QFN-48]  (part E of 5)

### Blocks framed on the sheet
To Decawave RF: P2 P4
To LED frontend: P1 P3

### Ports
DW_IRQn, DW_RSTn, DW_WakeUp, JTAG_TCK, JTAG_TMS, LED_DR0, LED_DR1, LED_DR2, LED_DR3, Net_CTRL, Net_INT, nRF51822_P0.22, nRF51822_P0.25, SPI_CSn_DW, SPI_CSn_Net, SPI_MISO, SPI_MOSI, SPI_SCK

### Nets
GND: P1.3 P1.4 P2.7 P3.1 P3.2 P3.7 P3.8 P4.7 P5.5
VCC_3.3_MAIN: P4.2 P5.1
VCC_LED_3.3: P1.5 P1.6 P1.7 P1.8
DW_IRQn: P4.1 ; port DW_IRQn
DW_RSTn: P4.3 ; port DW_RSTn
DW_WakeUp: P4.4 ; port DW_WakeUp
JTAG_TCK: P6.1 ; port JTAG_TCK
JTAG_TMS: P6.6 ; port JTAG_TMS
LED_DR0: P3.4 ; port LED_DR0
LED_DR1: P3.3 ; port LED_DR1
LED_DR2: P3.6 ; port LED_DR2
LED_DR3: P3.5 ; port LED_DR3
Net_CTRL: P4.5 ; port Net_CTRL
Net_INT: P4.6 ; port Net_INT
nRF51822_P0.22: P5.3 ; port nRF51822_P0.22
nRF51822_P0.25: P5.6 ; port nRF51822_P0.25
SPI_CSn_DW: P2.6 ; port SPI_CSn_DW
SPI_CSn_Net: P2.5 ; port SPI_CSn_Net
SPI_MISO: P2.3 ; port SPI_MISO
SPI_MOSI: P2.4 ; port SPI_MOSI
SPI_SCK: P2.1 ; port SPI_SCK
SWDCLK: P6.3 U4.24(SWDCLK)
SWDIO: P6.4 U4.23(SWDIO/~{nRESET})
VSYS: P1.1 P1.2 P2.2
NetP5_2: P5.2 P6.5
NetP5_4: P5.4 P6.2

Not connected (* = marked no-connect by the designer): P2 8; P4 8

### Notes on the sheet
- Title
- Date:
- Author:
- Revision:
- Sheet
- of
- University of Michigan
- File:

### Library data of the parts
P1 P3 = SSM-104-F-DV: Samtec 2x4 100 mil female connector
P2 P4 = CLP Header: Samtec CLP 2x4 0.05" Female Header
P5 = TC2030: TC2030-MCP-NL
P6 = CAS-220: DPDT dip switch; Supplier 1: Digi-Key; Supplier Part Number 1: CAS220JCT-ND
U4 = nRF51822: as U4 on sheet digital_IO; Supplier 1: Digi-Key; Supplier Part Number 1: 1490-1032-1-ND

## Nets that join several sheets
GND: digital_IO (C31.2 C32.2 C33.2 C34.2), flash (C35.2 U6.4 U6.9), power (31 pins), rf (17 pins), rtc (C46.2 Y5.6), usb (20 pins), connector (9 pins)
VCC_3.3_MAIN: digital_IO (R10.1 R11.1 R12.1), flash (C35.1 R25.1 R26.1 U6.8), power (29 pins), rf (U8.5), rtc (C46.1 R27.1 Y5.2), usb (R7.1), connector (P4.2 P5.1)
VCC_LED_3.3: power (C1.1 U1.1 U1.4), connector (P1.5 P1.6 P1.7 P1.8)
VCC_USB_5: power (C2.1 U2.4 U2.6), usb (C25.1 C26.1 FB1.2 J1.1)
CC2538/~{nRF51822}: digital_IO (U3.50), rf (C36.2 U7.6 U8.2)
DW_IRQn: digital_IO (R18.2), connector (P4.1)
DW_RSTn: digital_IO (U3.30), connector (P4.3)
DW_WakeUp: digital_IO (U3.31), connector (P4.4)
~{FLASH_CS}: digital_IO (U3.11), flash (U6.1)
~{FLASH_HOLD}: digital_IO (U3.8), flash (R25.2 U6.7)
~{FLASH_WP}: digital_IO (U3.9), flash (R26.2 U6.3)
JTAG_TCK: usb (U3.47), connector (P6.1)
JTAG_TMS: usb (U3.46), connector (P6.6)
LED_DR0: digital_IO (U3.23), connector (P3.4)
LED_DR1: digital_IO (U3.25), connector (P3.3)
LED_DR2: digital_IO (U3.26), connector (P3.6)
LED_DR3: digital_IO (U3.27), connector (P3.5)
Net_CTRL: digital_IO (U3.22), connector (P4.5)
Net_INT: digital_IO (R13.1), connector (P4.6)
NetU3_16: digital_IO (U3.16), usb (U5.30)
NetU3_17: digital_IO (U3.17), usb (U5.2)
NetU3_18: digital_IO (U3.18), usb (U5.31)
nRF51822_P0.22: digital_IO (U4.41), connector (P5.3)
nRF51822_P0.25: digital_IO (U4.44), connector (P5.6)
RTC_CLKOUT: digital_IO (R15.2 R24.2), rtc (Y5.3)
RTC_INT: digital_IO (R17.1), rtc (Y5.7)
SPI_CSn_DW: digital_IO (U3.53), connector (P2.6)
SPI_CSn_Net: digital_IO (U3.54), connector (P2.5)
SPI_MISO: digital_IO (R19.1 U4.4), flash (U6.2), rtc (Y5.5), connector (P2.3)
SPI_MOSI: digital_IO (R14.1 U4.6), flash (U6.5), rtc (Y5.10), connector (P2.4)
SPI_RTC_CS: digital_IO (U3.5), rtc (Y5.8)
SPI_SCK: digital_IO (R16.1 U4.5), flash (U6.6), rtc (Y5.4), connector (P2.1)